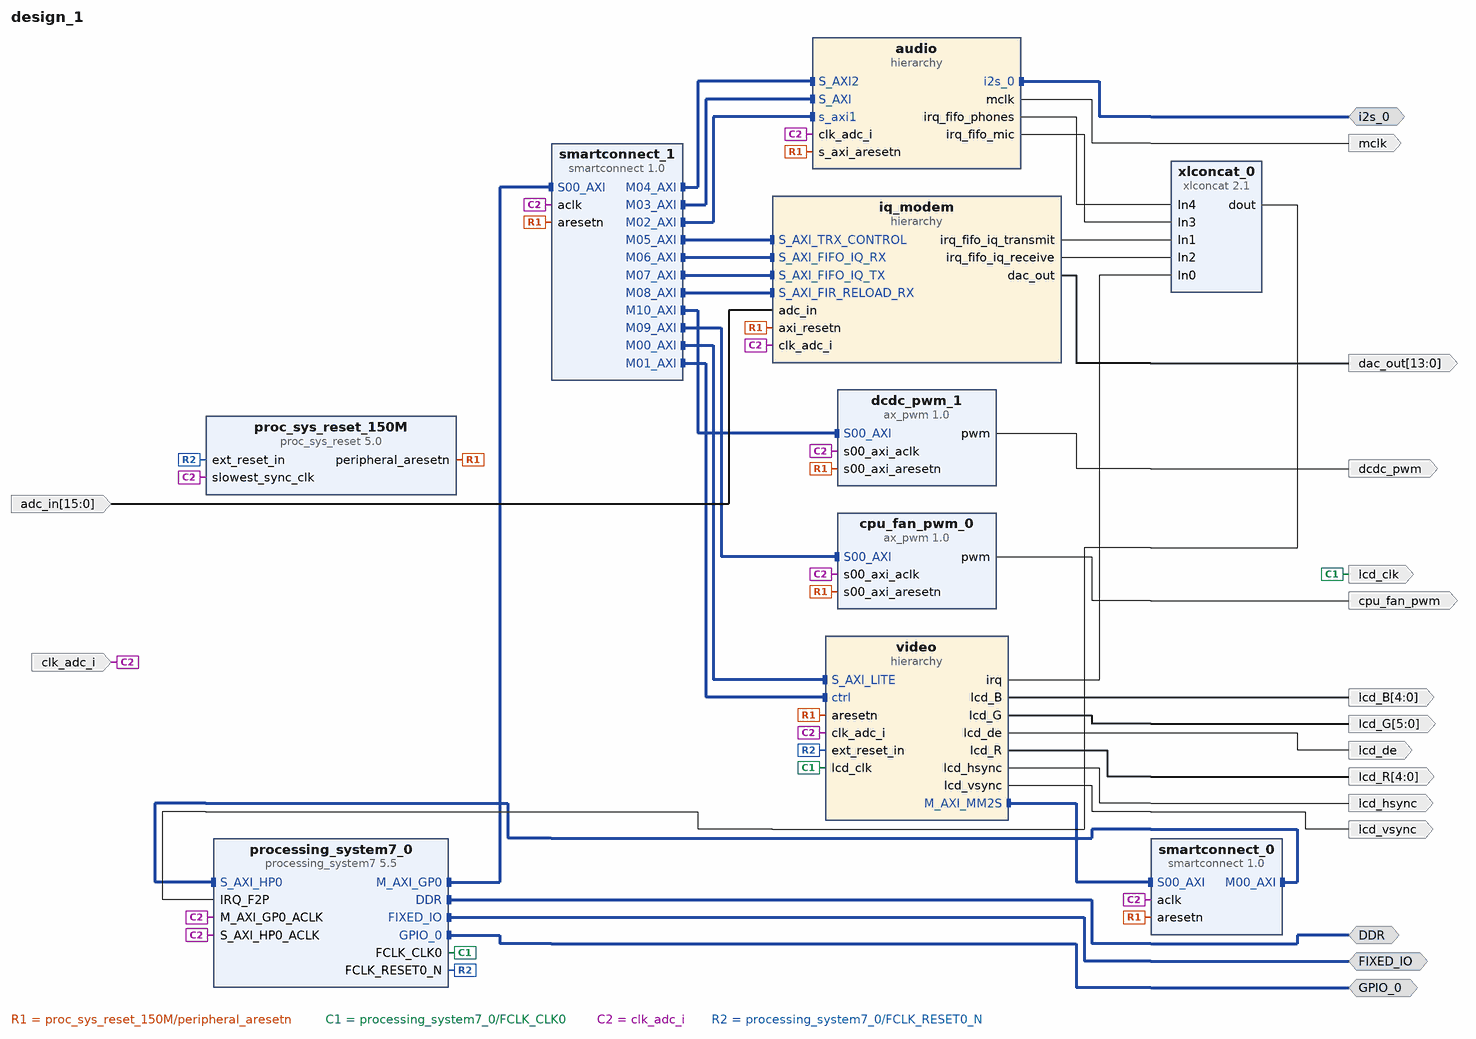
[diagram p0: block diagram of the top level]
# Vivado block design design_1, xc7z020clg400-2, Vivado 2021.1
create_bd_design design_1

create_bd_intf_port -mode Master -vlnv xilinx.com:interface:gpio_rtl:1.0 GPIO_0
create_bd_intf_port -mode Master -vlnv xilinx.com:interface:ddrx_rtl:1.0 DDR
create_bd_intf_port -mode Master -vlnv xilinx.com:display_processing_system7:fixedio_rtl:1.0 FIXED_IO
create_bd_intf_port -mode Master -vlnv analog.com:interface:i2s_rtl:1.0 i2s_0
create_bd_port -dir O -type clk mclk
set_property -dict {CONFIG.FREQ_HZ 12288000} [get_bd_ports mclk]
create_bd_port -dir I -from 15 -to 0 adc_in
create_bd_port -dir O -type clk lcd_clk
set_property -dict {CONFIG.FREQ_HZ 50000000} [get_bd_ports lcd_clk]
create_bd_port -dir O -from 4 -to 0 lcd_R
create_bd_port -dir O -from 5 -to 0 lcd_G
create_bd_port -dir O -from 4 -to 0 lcd_B
create_bd_port -dir O lcd_hsync
create_bd_port -dir O lcd_vsync
create_bd_port -dir O lcd_de
create_bd_port -dir O -from 13 -to 0 dac_out
create_bd_port -dir I -type clk clk_adc_i
set_property -dict {CONFIG.FREQ_HZ 122880000} [get_bd_ports clk_adc_i]
create_bd_port -dir O cpu_fan_pwm
create_bd_port -dir O dcdc_pwm

create_bd_cell -type ip -vlnv xilinx.com:ip:proc_sys_reset:5.0 proc_sys_reset_150M
create_bd_cell -type ip -vlnv xilinx.com:ip:smartconnect:1.0 smartconnect_0
set_property -dict {CONFIG.NUM_SI 1} [get_bd_cells smartconnect_0]
create_bd_cell -type ip -vlnv xilinx.com:ip:smartconnect:1.0 smartconnect_1
set_property -dict {CONFIG.NUM_MI 11 CONFIG.NUM_SI 1} [get_bd_cells smartconnect_1]
create_bd_cell -type ip -vlnv xilinx.com:ip:xlconcat:2.1 xlconcat_0
set_property -dict {CONFIG.NUM_PORTS 5 CONFIG.dout_width 5} [get_bd_cells xlconcat_0]
create_bd_cell -type ip -vlnv xilinx.com:ip:processing_system7:5.5 processing_system7_0
set_property -dict [list \
  CONFIG.PCW_APU_PERIPHERAL_FREQMHZ 767 \
  CONFIG.PCW_CPU_CPU_6X4X_MAX_RANGE 767 \
  CONFIG.PCW_ENET0_ENET0_IO {MIO 16 .. 27} \
  CONFIG.PCW_ENET0_GRP_MDIO_ENABLE 1 \
  CONFIG.PCW_ENET0_GRP_MDIO_IO {MIO 52 .. 53} \
  CONFIG.PCW_ENET0_PERIPHERAL_ENABLE 1 \
  CONFIG.PCW_ENET0_RESET_ENABLE 0 \
  CONFIG.PCW_ENET_RESET_ENABLE 1 \
  CONFIG.PCW_ENET_RESET_SELECT {Share reset pin} \
  CONFIG.PCW_FCLK2_PERIPHERAL_CLKSRC {ARM PLL} \
  CONFIG.PCW_FCLK_CLK0_BUF FALSE \
  CONFIG.PCW_FPGA0_PERIPHERAL_FREQMHZ 50 \
  CONFIG.PCW_FPGA1_PERIPHERAL_FREQMHZ 30 \
  CONFIG.PCW_FPGA2_PERIPHERAL_FREQMHZ 30 \
  CONFIG.PCW_GPIO_EMIO_GPIO_ENABLE 1 \
  CONFIG.PCW_GPIO_EMIO_GPIO_IO 32 \
  CONFIG.PCW_GPIO_EMIO_GPIO_WIDTH 32 \
  CONFIG.PCW_GPIO_MIO_GPIO_ENABLE 1 \
  CONFIG.PCW_GPIO_MIO_GPIO_IO MIO \
  CONFIG.PCW_I2C0_GRP_INT_ENABLE 0 \
  CONFIG.PCW_I2C0_I2C0_IO {MIO 42 .. 43} \
  CONFIG.PCW_I2C0_PERIPHERAL_ENABLE 1 \
  CONFIG.PCW_I2C_PERIPHERAL_FREQMHZ 127.777779 \
  CONFIG.PCW_I2C_RESET_ENABLE 0 \
  CONFIG.PCW_IRQ_F2P_INTR 1 \
  CONFIG.PCW_PERIPHERAL_BOARD_PRESET None \
  CONFIG.PCW_PRESET_BANK1_VOLTAGE {LVCMOS 1.8V} \
  CONFIG.PCW_QSPI_GRP_FBCLK_ENABLE 1 \
  CONFIG.PCW_QSPI_GRP_FBCLK_IO {MIO 8} \
  CONFIG.PCW_QSPI_GRP_SINGLE_SS_ENABLE 1 \
  CONFIG.PCW_QSPI_GRP_SINGLE_SS_IO {MIO 1 .. 6} \
  CONFIG.PCW_QSPI_INTERNAL_HIGHADDRESS 0xFDFFFFFF \
  CONFIG.PCW_QSPI_PERIPHERAL_ENABLE 1 \
  CONFIG.PCW_QSPI_QSPI_IO {MIO 1 .. 6} \
  CONFIG.PCW_SD0_PERIPHERAL_ENABLE 0 \
  CONFIG.PCW_SINGLE_QSPI_DATA_MODE x4 \
  CONFIG.PCW_UART1_PERIPHERAL_ENABLE 1 \
  CONFIG.PCW_UART1_UART1_IO {MIO 48 .. 49} \
  CONFIG.PCW_UART_PERIPHERAL_FREQMHZ 100 \
  CONFIG.PCW_UIPARAM_DDR_FREQ_MHZ 534 \
  CONFIG.PCW_UIPARAM_DDR_PARTNO {MT41K128M16 JT-125} \
  CONFIG.PCW_USB0_PERIPHERAL_ENABLE 1 \
  CONFIG.PCW_USB0_RESET_ENABLE 1 \
  CONFIG.PCW_USB0_RESET_IO {MIO 46} \
  CONFIG.PCW_USB0_USB0_IO {MIO 28 .. 39} \
  CONFIG.PCW_USB_RESET_ENABLE 1 \
  CONFIG.PCW_USB_RESET_SELECT {Share reset pin} \
  CONFIG.PCW_USE_FABRIC_INTERRUPT 1 \
  CONFIG.PCW_USE_S_AXI_HP0 1 \
  CONFIG.preset None \
] [get_bd_cells processing_system7_0]
# 502 more settings of processing_system7_0 are not shown: defaults, MIO pin electricals, DDR timing, and values the tool derives
create_bd_cell -type ip -vlnv xilinx.com:user:ax_pwm:1.0 cpu_fan_pwm_0
create_bd_cell -type ip -vlnv xilinx.com:user:ax_pwm:1.0 dcdc_pwm_1
create_bd_cell -type hier audio
create_bd_cell -type hier video
create_bd_cell -type hier iq_modem

# ---- hierarchy /audio ----
current_bd_instance /audio
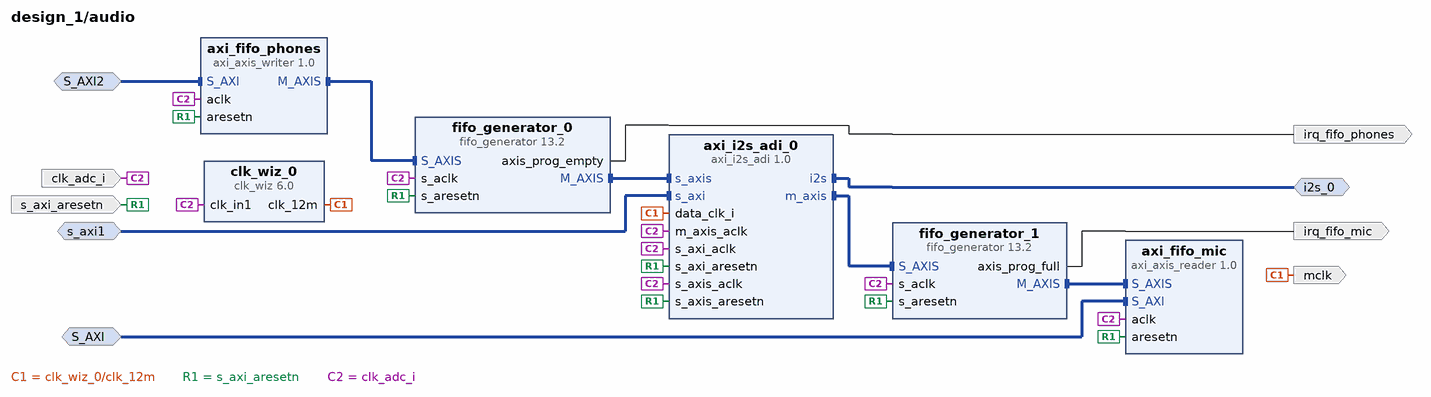
[diagram p1: block diagram inside /audio]
create_bd_intf_pin -mode Slave -vlnv xilinx.com:interface:aximm_rtl:1.0 s_axi1
create_bd_intf_pin -mode Master -vlnv analog.com:interface:i2s_rtl:1.0 i2s_0
create_bd_intf_pin -mode Slave -vlnv xilinx.com:interface:aximm_rtl:1.0 S_AXI
create_bd_intf_pin -mode Slave -vlnv xilinx.com:interface:aximm_rtl:1.0 S_AXI2
create_bd_pin -dir I -type clk clk_adc_i
create_bd_pin -dir I -type rst s_axi_aresetn
create_bd_pin -dir O -type clk mclk
create_bd_pin -dir O -type intr irq_fifo_phones
create_bd_pin -dir O -type intr irq_fifo_mic

create_bd_cell -type ip -vlnv analog.com:adi:axi_i2s_adi:1.0 axi_i2s_adi_0
set_property -dict {CONFIG.BCLK_POL 0 CONFIG.HAS_RX 1 CONFIG.HAS_TX 1 CONFIG.LRCLK_POL 0} [get_bd_cells axi_i2s_adi_0]
create_bd_cell -type ip -vlnv xilinx.com:ip:clk_wiz:6.0 clk_wiz_0
set_property -dict [list \
  CONFIG.CLKOUT1_JITTER 205.165 \
  CONFIG.CLKOUT1_PHASE_ERROR 112.102 \
  CONFIG.CLKOUT1_REQUESTED_OUT_FREQ 12.288 \
  CONFIG.CLK_OUT1_PORT clk_12m \
  CONFIG.MMCM_CLKFBOUT_MULT_F 6.125 \
  CONFIG.MMCM_CLKOUT0_DIVIDE_F 61.250 \
  CONFIG.MMCM_DIVCLK_DIVIDE 1 \
  CONFIG.USE_LOCKED false \
  CONFIG.USE_RESET false \
] [get_bd_cells clk_wiz_0]
create_bd_cell -type ip -vlnv xilinx.com:ip:fifo_generator:13.2 fifo_generator_0
set_property -dict [list \
  CONFIG.Empty_Threshold_Assert_Value_axis 132 \
  CONFIG.Enable_Safety_Circuit true \
  CONFIG.FIFO_Implementation_rach Common_Clock_Distributed_RAM \
  CONFIG.FIFO_Implementation_wach Common_Clock_Distributed_RAM \
  CONFIG.FIFO_Implementation_wrch Common_Clock_Distributed_RAM \
  CONFIG.Full_Flags_Reset_Value 1 \
  CONFIG.INTERFACE_TYPE AXI_STREAM \
  CONFIG.Input_Depth_axis 512 \
  CONFIG.Programmable_Empty_Type_axis Single_Programmable_Empty_Threshold_Constant \
  CONFIG.TDATA_NUM_BYTES 4 \
  CONFIG.TUSER_WIDTH 0 \
] [get_bd_cells fifo_generator_0]
create_bd_cell -type ip -vlnv xilinx.com:ip:fifo_generator:13.2 fifo_generator_1
set_property -dict [list \
  CONFIG.Enable_Safety_Circuit true \
  CONFIG.FIFO_Implementation_rach Common_Clock_Distributed_RAM \
  CONFIG.FIFO_Implementation_wach Common_Clock_Distributed_RAM \
  CONFIG.FIFO_Implementation_wrch Common_Clock_Distributed_RAM \
  CONFIG.Full_Flags_Reset_Value 1 \
  CONFIG.Full_Threshold_Assert_Value_axis 132 \
  CONFIG.INTERFACE_TYPE AXI_STREAM \
  CONFIG.Input_Depth_axis 256 \
  CONFIG.Programmable_Full_Type_axis Single_Programmable_Full_Threshold_Constant \
  CONFIG.TDATA_NUM_BYTES 4 \
  CONFIG.TUSER_WIDTH 0 \
] [get_bd_cells fifo_generator_1]
create_bd_cell -type ip -vlnv pavel-demin:user:axi_axis_reader:1.0 axi_fifo_mic
create_bd_cell -type ip -vlnv pavel-demin:user:axi_axis_writer:1.0 axi_fifo_phones

# ---- hierarchy /video ----
current_bd_instance /video
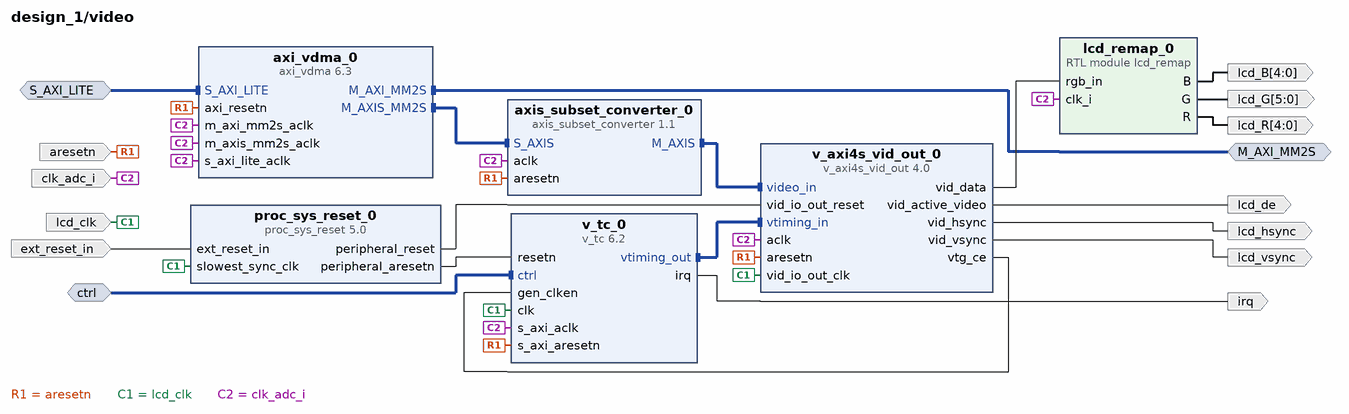
[diagram p2: block diagram inside /video]
create_bd_intf_pin -mode Slave -vlnv xilinx.com:interface:aximm_rtl:1.0 S_AXI_LITE
create_bd_intf_pin -mode Master -vlnv xilinx.com:interface:aximm_rtl:1.0 M_AXI_MM2S
create_bd_intf_pin -mode Slave -vlnv xilinx.com:interface:aximm_rtl:1.0 ctrl
create_bd_pin -dir I -type clk clk_adc_i
create_bd_pin -dir I -type rst aresetn
create_bd_pin -dir I -type clk lcd_clk
create_bd_pin -dir I -type rst ext_reset_in
create_bd_pin -dir O -type intr irq
create_bd_pin -dir O -from 4 -to 0 lcd_R
create_bd_pin -dir O -from 5 -to 0 lcd_G
create_bd_pin -dir O -from 4 -to 0 lcd_B
create_bd_pin -dir O lcd_vsync
create_bd_pin -dir O lcd_de
create_bd_pin -dir O lcd_hsync

create_bd_cell -type ip -vlnv xilinx.com:ip:axi_vdma:6.3 axi_vdma_0
set_property -dict [list \
  CONFIG.C_FAMILY zynquplus \
  CONFIG.c_addr_width 32 \
  CONFIG.c_include_mm2s 1 \
  CONFIG.c_include_mm2s_dre 0 \
  CONFIG.c_include_s2mm 0 \
  CONFIG.c_m_axi_mm2s_data_width 32 \
  CONFIG.c_m_axis_mm2s_tdata_width 32 \
  CONFIG.c_mm2s_genlock_mode 3 \
  CONFIG.c_mm2s_linebuffer_depth 2048 \
  CONFIG.c_mm2s_max_burst_length 16 \
  CONFIG.c_num_fstores 3 \
] [get_bd_cells axi_vdma_0]
create_bd_cell -type ip -vlnv xilinx.com:ip:axis_subset_converter:1.1 axis_subset_converter_0
set_property -dict [list \
  CONFIG.M_HAS_TKEEP 1 \
  CONFIG.M_HAS_TLAST 1 \
  CONFIG.M_TDATA_NUM_BYTES 3 \
  CONFIG.M_TUSER_WIDTH 1 \
  CONFIG.S_HAS_TKEEP 1 \
  CONFIG.S_HAS_TLAST 1 \
  CONFIG.S_TDATA_NUM_BYTES 4 \
  CONFIG.S_TUSER_WIDTH 1 \
  CONFIG.TDATA_REMAP {tdata[23:0]} \
  CONFIG.TKEEP_REMAP {tkeep[2:0]} \
  CONFIG.TLAST_REMAP {tlast[0]} \
  CONFIG.TUSER_REMAP {tuser[0:0]} \
] [get_bd_cells axis_subset_converter_0]
create_bd_cell -type ip -vlnv xilinx.com:ip:proc_sys_reset:5.0 proc_sys_reset_0
create_bd_cell -type ip -vlnv xilinx.com:ip:v_tc:6.2 v_tc_0
set_property -dict {CONFIG.enable_detection false} [get_bd_cells v_tc_0]
create_bd_cell -type module -reference lcd_remap lcd_remap_0
create_bd_cell -type ip -vlnv xilinx.com:ip:v_axi4s_vid_out:4.0 v_axi4s_vid_out_0
set_property -dict {CONFIG.C_ADDR_WIDTH 12 CONFIG.C_HAS_ASYNC_CLK 1 CONFIG.C_VTG_MASTER_SLAVE 1} [get_bd_cells v_axi4s_vid_out_0]

# ---- hierarchy /iq_modem ----
current_bd_instance /iq_modem
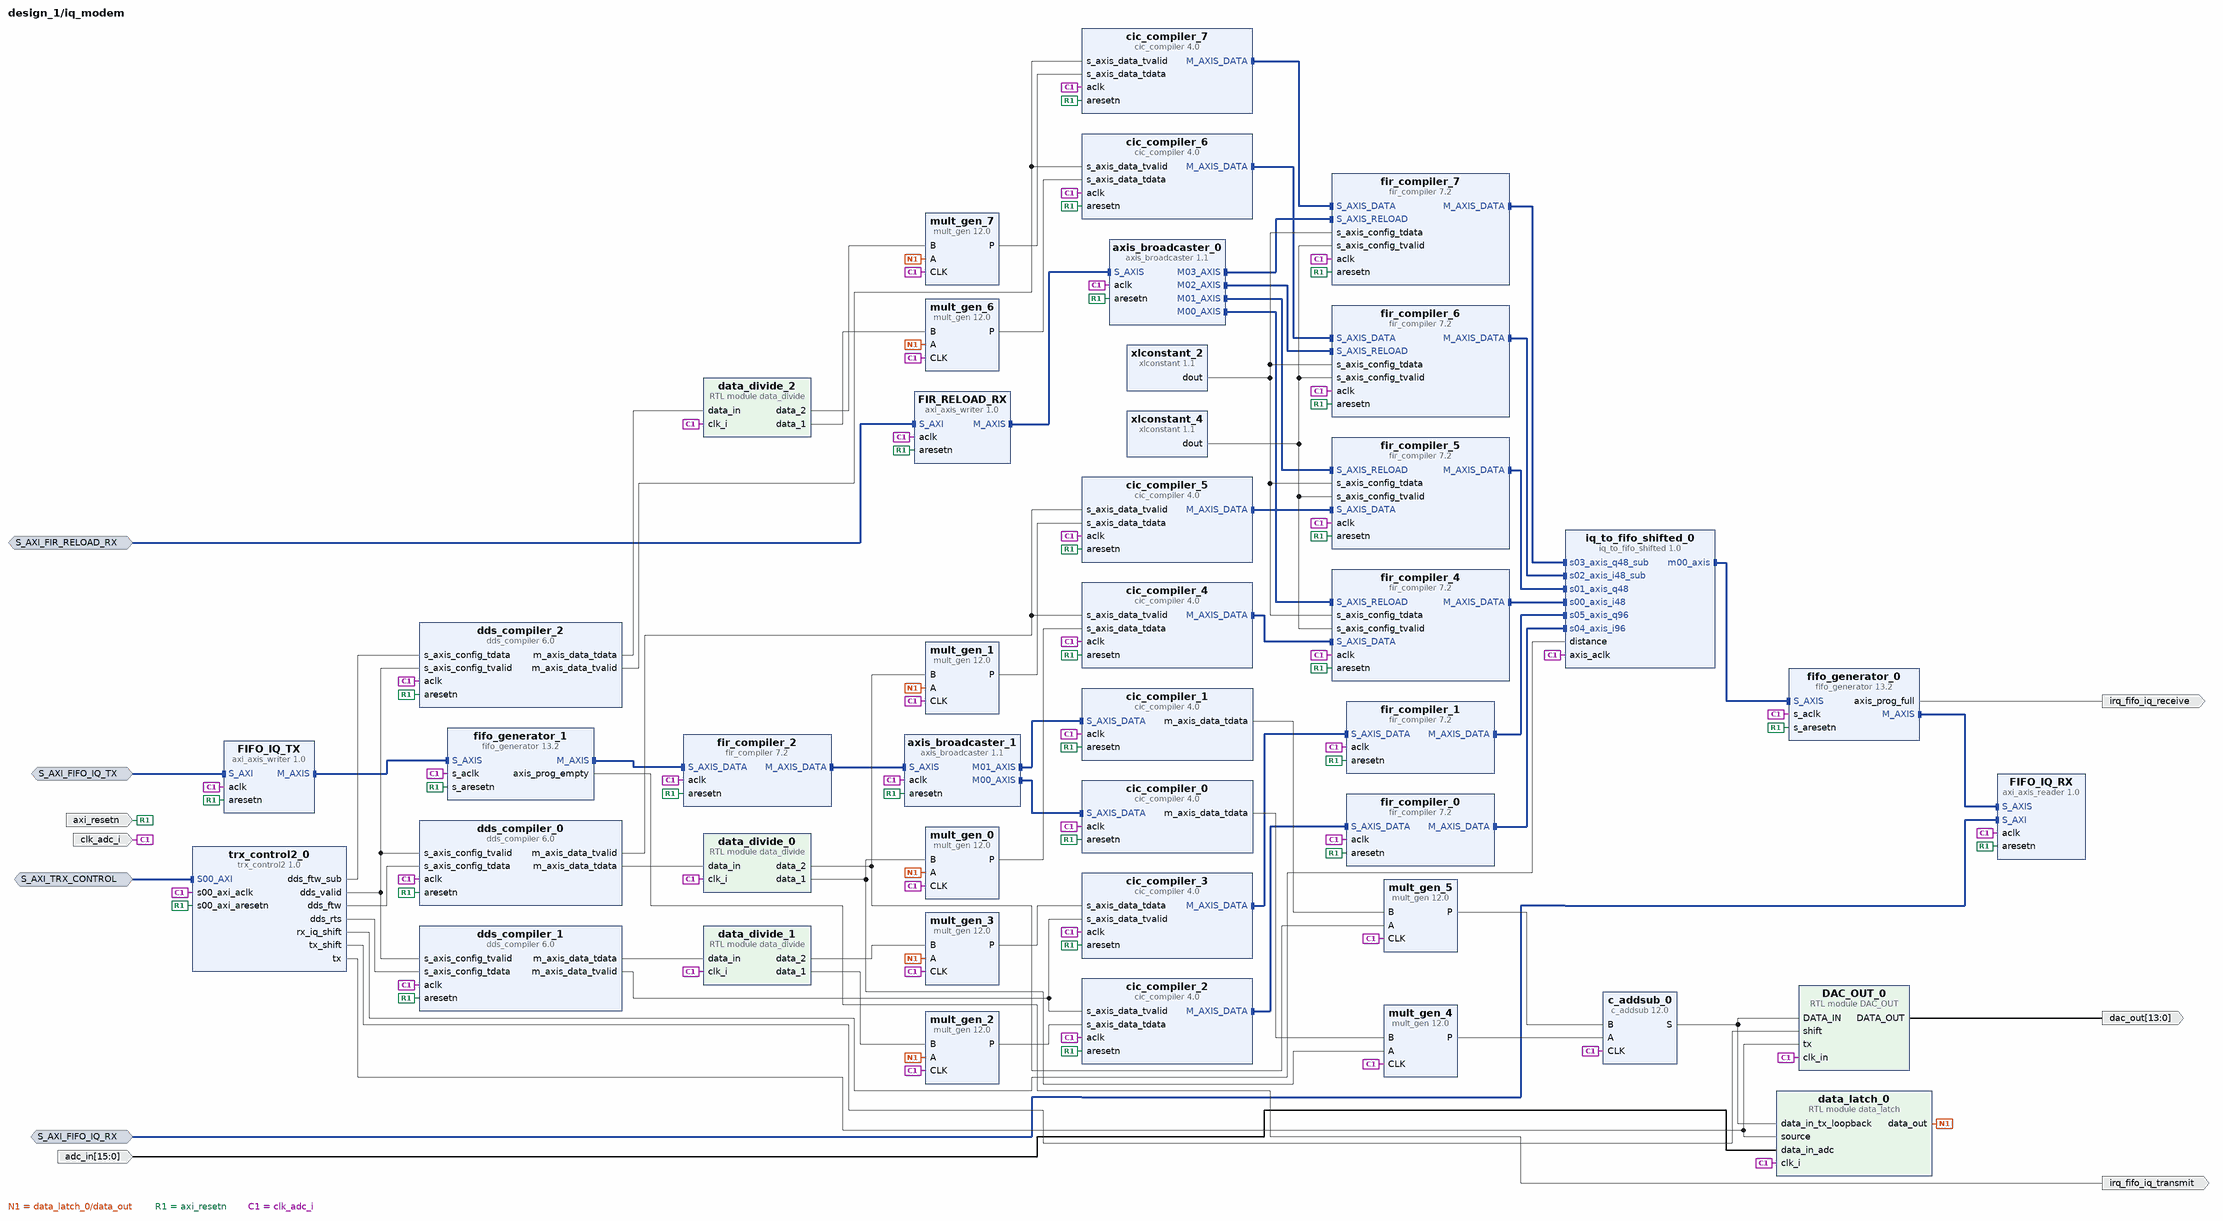
[diagram p3: block diagram inside /iq_modem]
create_bd_intf_pin -mode Slave -vlnv xilinx.com:interface:aximm_rtl:1.0 S_AXI_TRX_CONTROL
create_bd_intf_pin -mode Slave -vlnv xilinx.com:interface:aximm_rtl:1.0 S_AXI_FIFO_IQ_RX
create_bd_intf_pin -mode Slave -vlnv xilinx.com:interface:aximm_rtl:1.0 S_AXI_FIFO_IQ_TX
create_bd_intf_pin -mode Slave -vlnv xilinx.com:interface:aximm_rtl:1.0 S_AXI_FIR_RELOAD_RX
create_bd_pin -dir I -type clk clk_adc_i
create_bd_pin -dir I -type rst axi_resetn
create_bd_pin -dir I -from 15 -to 0 adc_in
create_bd_pin -dir O -from 13 -to 0 dac_out
create_bd_pin -dir O -type intr irq_fifo_iq_transmit
create_bd_pin -dir O -type intr irq_fifo_iq_receive

create_bd_cell -type ip -vlnv xilinx.com:user:trx_control2:1.0 trx_control2_0
create_bd_cell -type ip -vlnv xilinx.com:ip:dds_compiler:6.0 dds_compiler_2
set_property -dict [list \
  CONFIG.DATA_Has_TLAST Not_Required \
  CONFIG.DDS_Clock_Rate 122.88 \
  CONFIG.DSP48_Use Maximal \
  CONFIG.Frequency_Resolution 0.4 \
  CONFIG.Has_ARESETn true \
  CONFIG.Has_Phase_Out false \
  CONFIG.Latency 9 \
  CONFIG.M_DATA_Has_TUSER Not_Required \
  CONFIG.Noise_Shaping None \
  CONFIG.Optimization_Goal Speed \
  CONFIG.Output_Frequency1 0 \
  CONFIG.Output_Width 16 \
  CONFIG.PINC1 1101010101010101 \
  CONFIG.Parameter_Entry Hardware_Parameters \
  CONFIG.Phase_Increment Programmable \
  CONFIG.Phase_Width 32 \
  CONFIG.S_PHASE_Has_TUSER Not_Required \
] [get_bd_cells dds_compiler_2]
create_bd_cell -type ip -vlnv xilinx.com:ip:cic_compiler:4.0 cic_compiler_7
set_property -dict [list \
  CONFIG.Clock_Frequency 200.0 \
  CONFIG.Filter_Type Decimation \
  CONFIG.Fixed_Or_Initial_Rate 2560 \
  CONFIG.HAS_ARESETN true \
  CONFIG.Input_Data_Width 31 \
  CONFIG.Input_Sample_Frequency 0.001 \
  CONFIG.Maximum_Rate 2560 \
  CONFIG.Minimum_Rate 2560 \
  CONFIG.Number_Of_Channels 1 \
  CONFIG.Number_Of_Stages 6 \
  CONFIG.Output_Data_Width 32 \
  CONFIG.Quantization Truncation \
  CONFIG.RateSpecification Sample_Period \
  CONFIG.SamplePeriod 1 \
] [get_bd_cells cic_compiler_7]
create_bd_cell -type ip -vlnv xilinx.com:ip:axis_broadcaster:1.1 axis_broadcaster_0
set_property -dict [list \
  CONFIG.HAS_TLAST 1 \
  CONFIG.HAS_TREADY 1 \
  CONFIG.M00_TDATA_REMAP {tdata[31],tdata[22:0]} \
  CONFIG.M01_TDATA_REMAP {tdata[31],tdata[22:0]} \
  CONFIG.M02_TDATA_REMAP {tdata[31],tdata[22:0]} \
  CONFIG.M03_TDATA_REMAP {tdata[31],tdata[22:0]} \
  CONFIG.M04_TDATA_REMAP {tdata[31],tdata[22:0]} \
  CONFIG.M05_TDATA_REMAP {tdata[31],tdata[22:0]} \
  CONFIG.M_TDATA_NUM_BYTES 3 \
  CONFIG.NUM_MI 4 \
  CONFIG.S_TDATA_NUM_BYTES 4 \
] [get_bd_cells axis_broadcaster_0]
create_bd_cell -type ip -vlnv xilinx.com:ip:axis_broadcaster:1.1 axis_broadcaster_1
set_property -dict [list \
  CONFIG.HAS_TLAST 1 \
  CONFIG.HAS_TREADY 1 \
  CONFIG.M00_TDATA_REMAP {tdata[15:0]} \
  CONFIG.M01_TDATA_REMAP {tdata[31:16]} \
  CONFIG.M_TDATA_NUM_BYTES 2 \
  CONFIG.S_TDATA_NUM_BYTES 4 \
] [get_bd_cells axis_broadcaster_1]
create_bd_cell -type ip -vlnv xilinx.com:ip:mult_gen:12.0 mult_gen_0
set_property -dict [list \
  CONFIG.Multiplier_Construction Use_Mults \
  CONFIG.PipeStages 4 \
  CONFIG.PortAWidth 16 \
  CONFIG.PortBWidth 16 \
  CONFIG.Use_Custom_Output_Width false \
] [get_bd_cells mult_gen_0]
create_bd_cell -type ip -vlnv xilinx.com:ip:fir_compiler:7.2 fir_compiler_0
set_property -dict [list \
  CONFIG.Clock_Frequency 122.88 \
  CONFIG.CoefficientSource COE_File \
  CONFIG.Coefficient_File ../../../../../../src/fir.coe \
  CONFIG.Coefficient_Fractional_Bits 1 \
  CONFIG.Coefficient_Sets 1 \
  CONFIG.Coefficient_Sign Signed \
  CONFIG.Coefficient_Structure Non_Symmetric \
  CONFIG.Coefficient_Width 24 \
  CONFIG.ColumnConfig 1 \
  CONFIG.Data_Fractional_Bits 0 \
  CONFIG.Data_Sign Signed \
  CONFIG.Data_Width 32 \
  CONFIG.Decimation_Rate 2 \
  CONFIG.Filter_Architecture Systolic_Multiply_Accumulate \
  CONFIG.Filter_Type Decimation \
  CONFIG.Has_ACLKEN false \
  CONFIG.Has_ARESETn true \
  CONFIG.Interpolation_Rate 1 \
  CONFIG.Number_Channels 1 \
  CONFIG.Output_Rounding_Mode Convergent_Rounding_to_Even \
  CONFIG.Output_Width 32 \
  CONFIG.Quantization Normalize_to_Centre_Coefficient \
  CONFIG.RateSpecification Frequency_Specification \
  CONFIG.S_DATA_Has_FIFO false \
  CONFIG.Sample_Frequency 0.192 \
  CONFIG.Zero_Pack_Factor 1 \
] [get_bd_cells fir_compiler_0]
create_bd_cell -type ip -vlnv xilinx.com:ip:mult_gen:12.0 mult_gen_1
set_property -dict [list \
  CONFIG.Multiplier_Construction Use_Mults \
  CONFIG.PipeStages 4 \
  CONFIG.PortAWidth 16 \
  CONFIG.PortBWidth 16 \
  CONFIG.Use_Custom_Output_Width false \
] [get_bd_cells mult_gen_1]
create_bd_cell -type ip -vlnv xilinx.com:ip:fir_compiler:7.2 fir_compiler_1
set_property -dict [list \
  CONFIG.Clock_Frequency 122.88 \
  CONFIG.CoefficientSource COE_File \
  CONFIG.Coefficient_File ../../../../../../src/fir.coe \
  CONFIG.Coefficient_Fractional_Bits 1 \
  CONFIG.Coefficient_Sets 1 \
  CONFIG.Coefficient_Sign Signed \
  CONFIG.Coefficient_Structure Non_Symmetric \
  CONFIG.Coefficient_Width 24 \
  CONFIG.ColumnConfig 1 \
  CONFIG.Data_Fractional_Bits 0 \
  CONFIG.Data_Sign Signed \
  CONFIG.Data_Width 32 \
  CONFIG.Decimation_Rate 2 \
  CONFIG.Filter_Architecture Systolic_Multiply_Accumulate \
  CONFIG.Filter_Type Decimation \
  CONFIG.Has_ACLKEN false \
  CONFIG.Has_ARESETn true \
  CONFIG.Interpolation_Rate 1 \
  CONFIG.Number_Channels 1 \
  CONFIG.Output_Rounding_Mode Convergent_Rounding_to_Even \
  CONFIG.Output_Width 32 \
  CONFIG.Quantization Normalize_to_Centre_Coefficient \
  CONFIG.RateSpecification Frequency_Specification \
  CONFIG.S_DATA_Has_FIFO false \
  CONFIG.Sample_Frequency 0.192 \
  CONFIG.Zero_Pack_Factor 1 \
] [get_bd_cells fir_compiler_1]
create_bd_cell -type ip -vlnv xilinx.com:ip:mult_gen:12.0 mult_gen_2
set_property -dict [list \
  CONFIG.Multiplier_Construction Use_Mults \
  CONFIG.PipeStages 4 \
  CONFIG.PortAWidth 16 \
  CONFIG.PortBWidth 16 \
] [get_bd_cells mult_gen_2]
create_bd_cell -type ip -vlnv xilinx.com:ip:fir_compiler:7.2 fir_compiler_2
set_property -dict [list \
  CONFIG.Clock_Frequency 122.88 \
  CONFIG.CoefficientSource COE_File \
  CONFIG.CoefficientVector 6,0,-4,-3,5,6,-6,-13,7,44,64,44,7,-13,-6,6,5,-3,-4,0,6 \
  CONFIG.Coefficient_File ../../../../../../src/fir.coe \
  CONFIG.Coefficient_Fractional_Bits 1 \
  CONFIG.Coefficient_Reload false \
  CONFIG.Coefficient_Sets 1 \
  CONFIG.Coefficient_Sign Signed \
  CONFIG.Coefficient_Structure Non_Symmetric \
  CONFIG.Coefficient_Width 24 \
  CONFIG.Data_Fractional_Bits 0 \
  CONFIG.Data_Sign Signed \
  CONFIG.Data_Width 16 \
  CONFIG.Decimation_Rate 1 \
  CONFIG.Filter_Architecture Systolic_Multiply_Accumulate \
  CONFIG.Filter_Type Single_Rate \
  CONFIG.Has_ACLKEN false \
  CONFIG.Has_ARESETn true \
  CONFIG.Interpolation_Rate 1 \
  CONFIG.M_DATA_Has_TREADY true \
  CONFIG.Number_Channels 1 \
  CONFIG.Number_Paths 2 \
  CONFIG.Output_Rounding_Mode Truncate_LSBs \
  CONFIG.Output_Width 16 \
  CONFIG.Quantization Normalize_to_Centre_Coefficient \
  CONFIG.RateSpecification Frequency_Specification \
  CONFIG.Sample_Frequency 0.048 \
  CONFIG.Zero_Pack_Factor 1 \
] [get_bd_cells fir_compiler_2]
create_bd_cell -type ip -vlnv xilinx.com:user:iq_to_fifo_shifted:1.0 iq_to_fifo_shifted_0
set_property -dict {CONFIG.iq_width 56} [get_bd_cells iq_to_fifo_shifted_0]
create_bd_cell -type ip -vlnv xilinx.com:ip:mult_gen:12.0 mult_gen_3
set_property -dict [list \
  CONFIG.Multiplier_Construction Use_Mults \
  CONFIG.PipeStages 4 \
  CONFIG.PortAWidth 16 \
  CONFIG.PortBWidth 16 \
] [get_bd_cells mult_gen_3]
create_bd_cell -type ip -vlnv xilinx.com:ip:xlconstant:1.1 xlconstant_2
set_property -dict {CONFIG.CONST_VAL 0 CONFIG.CONST_WIDTH 8} [get_bd_cells xlconstant_2]
create_bd_cell -type ip -vlnv xilinx.com:ip:cic_compiler:4.0 cic_compiler_0
set_property -dict [list \
  CONFIG.Clock_Frequency 122.88 \
  CONFIG.Fixed_Or_Initial_Rate 2560 \
  CONFIG.HAS_ARESETN true \
  CONFIG.Input_Data_Width 16 \
  CONFIG.Input_Sample_Frequency 0.048 \
  CONFIG.Maximum_Rate 2560 \
  CONFIG.Minimum_Rate 2560 \
  CONFIG.Number_Of_Stages 6 \
  CONFIG.Output_Data_Width 16 \
  CONFIG.Quantization Truncation \
  CONFIG.SamplePeriod 2560 \
] [get_bd_cells cic_compiler_0]
create_bd_cell -type ip -vlnv xilinx.com:ip:c_addsub:12.0 c_addsub_0
set_property -dict [list \
  CONFIG.A_Type Signed \
  CONFIG.A_Width 27 \
  CONFIG.B_Type Signed \
  CONFIG.B_Value 000000000000000000000000000 \
  CONFIG.B_Width 27 \
  CONFIG.CE false \
  CONFIG.Implementation DSP48 \
  CONFIG.Latency 2 \
  CONFIG.Latency_Configuration Automatic \
  CONFIG.Out_Width 27 \
] [get_bd_cells c_addsub_0]
create_bd_cell -type ip -vlnv xilinx.com:ip:cic_compiler:4.0 cic_compiler_1
set_property -dict [list \
  CONFIG.Clock_Frequency 122.88 \
  CONFIG.Fixed_Or_Initial_Rate 2560 \
  CONFIG.HAS_ARESETN true \
  CONFIG.Input_Data_Width 16 \
  CONFIG.Input_Sample_Frequency 0.048 \
  CONFIG.Maximum_Rate 2560 \
  CONFIG.Minimum_Rate 2560 \
  CONFIG.Number_Of_Stages 6 \
  CONFIG.Output_Data_Width 16 \
  CONFIG.Quantization Truncation \
  CONFIG.SamplePeriod 2560 \
] [get_bd_cells cic_compiler_1]
create_bd_cell -type module -reference data_latch data_latch_0
create_bd_cell -type ip -vlnv xilinx.com:ip:fir_compiler:7.2 fir_compiler_4
set_property -dict [list \
  CONFIG.Clock_Frequency 122.88 \
  CONFIG.CoefficientSource COE_File \
  CONFIG.Coefficient_File ../../../../../../src/fir.coe \
  CONFIG.Coefficient_Fractional_Bits 1 \
  CONFIG.Coefficient_Reload true \
  CONFIG.Coefficient_Sets 1 \
  CONFIG.Coefficient_Sign Signed \
  CONFIG.Coefficient_Structure Non_Symmetric \
  CONFIG.Coefficient_Width 24 \
  CONFIG.Data_Fractional_Bits 0 \
  CONFIG.Data_Sign Signed \
  CONFIG.Data_Width 32 \
  CONFIG.Filter_Architecture Systolic_Multiply_Accumulate \
  CONFIG.Has_ARESETn true \
  CONFIG.Output_Rounding_Mode Truncate_LSBs \
  CONFIG.Output_Width 56 \
  CONFIG.Quantization Normalize_to_Centre_Coefficient \
  CONFIG.Sample_Frequency 0.048 \
] [get_bd_cells fir_compiler_4]
create_bd_cell -type ip -vlnv xilinx.com:ip:mult_gen:12.0 mult_gen_4
set_property -dict [list \
  CONFIG.OutputWidthHigh 30 \
  CONFIG.OutputWidthLow 4 \
  CONFIG.PortAType Signed \
  CONFIG.PortAWidth 16 \
  CONFIG.PortBType Signed \
  CONFIG.PortBWidth 16 \
  CONFIG.Use_Custom_Output_Width true \
] [get_bd_cells mult_gen_4]
create_bd_cell -type module -reference DAC_OUT DAC_OUT_0
create_bd_cell -type ip -vlnv xilinx.com:ip:mult_gen:12.0 mult_gen_5
set_property -dict [list \
  CONFIG.OutputWidthHigh 30 \
  CONFIG.OutputWidthLow 4 \
  CONFIG.PortAType Signed \
  CONFIG.PortAWidth 16 \
  CONFIG.PortBType Signed \
  CONFIG.PortBWidth 16 \
  CONFIG.Use_Custom_Output_Width true \
] [get_bd_cells mult_gen_5]
create_bd_cell -type ip -vlnv xilinx.com:ip:fir_compiler:7.2 fir_compiler_5
set_property -dict [list \
  CONFIG.Clock_Frequency 122.88 \
  CONFIG.CoefficientSource COE_File \
  CONFIG.Coefficient_File ../../../../../../src/fir.coe \
  CONFIG.Coefficient_Fractional_Bits 1 \
  CONFIG.Coefficient_Reload true \
  CONFIG.Coefficient_Sets 1 \
  CONFIG.Coefficient_Sign Signed \
  CONFIG.Coefficient_Structure Non_Symmetric \
  CONFIG.Coefficient_Width 24 \
  CONFIG.Data_Fractional_Bits 0 \
  CONFIG.Data_Sign Signed \
  CONFIG.Data_Width 32 \
  CONFIG.Filter_Architecture Systolic_Multiply_Accumulate \
  CONFIG.Has_ARESETn true \
  CONFIG.Output_Rounding_Mode Truncate_LSBs \
  CONFIG.Output_Width 56 \
  CONFIG.Quantization Normalize_to_Centre_Coefficient \
  CONFIG.Sample_Frequency 0.048 \
] [get_bd_cells fir_compiler_5]
create_bd_cell -type ip -vlnv xilinx.com:ip:cic_compiler:4.0 cic_compiler_2
set_property -dict [list \
  CONFIG.Clock_Frequency 200.0 \
  CONFIG.Filter_Type Decimation \
  CONFIG.Fixed_Or_Initial_Rate 640 \
  CONFIG.HAS_ACLKEN false \
  CONFIG.HAS_ARESETN true \
  CONFIG.Input_Data_Width 31 \
  CONFIG.Input_Sample_Frequency 0.001 \
  CONFIG.Maximum_Rate 640 \
  CONFIG.Minimum_Rate 640 \
  CONFIG.Number_Of_Stages 6 \
  CONFIG.Output_Data_Width 32 \
  CONFIG.Quantization Truncation \
  CONFIG.RateSpecification Sample_Period \
  CONFIG.SamplePeriod 1 \
  CONFIG.Use_Xtreme_DSP_Slice false \
] [get_bd_cells cic_compiler_2]
create_bd_cell -type module -reference data_divide data_divide_0
create_bd_cell -type ip -vlnv xilinx.com:ip:xlconstant:1.1 xlconstant_4
set_property -dict {CONFIG.CONST_VAL 1 CONFIG.CONST_WIDTH 1} [get_bd_cells xlconstant_4]
create_bd_cell -type ip -vlnv xilinx.com:ip:fir_compiler:7.2 fir_compiler_6
set_property -dict [list \
  CONFIG.Clock_Frequency 122.88 \
  CONFIG.CoefficientSource COE_File \
  CONFIG.Coefficient_File ../../../../../../src/fir.coe \
  CONFIG.Coefficient_Fractional_Bits 1 \
  CONFIG.Coefficient_Reload true \
  CONFIG.Coefficient_Sets 1 \
  CONFIG.Coefficient_Sign Signed \
  CONFIG.Coefficient_Structure Non_Symmetric \
  CONFIG.Coefficient_Width 24 \
  CONFIG.Data_Fractional_Bits 0 \
  CONFIG.Data_Sign Signed \
  CONFIG.Data_Width 32 \
  CONFIG.Filter_Architecture Systolic_Multiply_Accumulate \
  CONFIG.Has_ARESETn true \
  CONFIG.Output_Rounding_Mode Truncate_LSBs \
  CONFIG.Output_Width 56 \
  CONFIG.Quantization Normalize_to_Centre_Coefficient \
  CONFIG.Sample_Frequency 0.048 \
] [get_bd_cells fir_compiler_6]
create_bd_cell -type module -reference data_divide data_divide_1
create_bd_cell -type ip -vlnv xilinx.com:ip:mult_gen:12.0 mult_gen_6
set_property -dict [list \
  CONFIG.Multiplier_Construction Use_Mults \
  CONFIG.PipeStages 4 \
  CONFIG.PortAWidth 16 \
  CONFIG.PortBWidth 16 \
  CONFIG.Use_Custom_Output_Width false \
] [get_bd_cells mult_gen_6]
create_bd_cell -type ip -vlnv xilinx.com:ip:cic_compiler:4.0 cic_compiler_3
set_property -dict [list \
  CONFIG.Clock_Frequency 200.0 \
  CONFIG.Filter_Type Decimation \
  CONFIG.Fixed_Or_Initial_Rate 640 \
  CONFIG.HAS_ACLKEN false \
  CONFIG.HAS_ARESETN true \
  CONFIG.Input_Data_Width 31 \
  CONFIG.Input_Sample_Frequency 0.001 \
  CONFIG.Maximum_Rate 640 \
  CONFIG.Minimum_Rate 640 \
  CONFIG.Number_Of_Stages 6 \
  CONFIG.Output_Data_Width 32 \
  CONFIG.Quantization Truncation \
  CONFIG.RateSpecification Sample_Period \
  CONFIG.SamplePeriod 1 \
  CONFIG.Use_Xtreme_DSP_Slice false \
] [get_bd_cells cic_compiler_3]
create_bd_cell -type ip -vlnv xilinx.com:ip:cic_compiler:4.0 cic_compiler_4
set_property -dict [list \
  CONFIG.Clock_Frequency 200.0 \
  CONFIG.Filter_Type Decimation \
  CONFIG.Fixed_Or_Initial_Rate 2560 \
  CONFIG.HAS_ARESETN true \
  CONFIG.Input_Data_Width 31 \
  CONFIG.Input_Sample_Frequency 0.001 \
  CONFIG.Maximum_Rate 2560 \
  CONFIG.Minimum_Rate 2560 \
  CONFIG.Number_Of_Channels 1 \
  CONFIG.Number_Of_Stages 6 \
  CONFIG.Output_Data_Width 32 \
  CONFIG.Quantization Truncation \
  CONFIG.RateSpecification Sample_Period \
  CONFIG.SamplePeriod 1 \
] [get_bd_cells cic_compiler_4]
create_bd_cell -type ip -vlnv xilinx.com:ip:fir_compiler:7.2 fir_compiler_7
set_property -dict [list \
  CONFIG.Clock_Frequency 122.88 \
  CONFIG.CoefficientSource COE_File \
  CONFIG.Coefficient_File ../../../../../../src/fir.coe \
  CONFIG.Coefficient_Fractional_Bits 1 \
  CONFIG.Coefficient_Reload true \
  CONFIG.Coefficient_Sets 1 \
  CONFIG.Coefficient_Sign Signed \
  CONFIG.Coefficient_Structure Non_Symmetric \
  CONFIG.Coefficient_Width 24 \
  CONFIG.Data_Fractional_Bits 0 \
  CONFIG.Data_Sign Signed \
  CONFIG.Data_Width 32 \
  CONFIG.Filter_Architecture Systolic_Multiply_Accumulate \
  CONFIG.Has_ARESETn true \
  CONFIG.Output_Rounding_Mode Truncate_LSBs \
  CONFIG.Output_Width 56 \
  CONFIG.Quantization Normalize_to_Centre_Coefficient \
  CONFIG.Sample_Frequency 0.048 \
] [get_bd_cells fir_compiler_7]
create_bd_cell -type ip -vlnv xilinx.com:ip:mult_gen:12.0 mult_gen_7
set_property -dict [list \
  CONFIG.Multiplier_Construction Use_Mults \
  CONFIG.PipeStages 4 \
  CONFIG.PortAWidth 16 \
  CONFIG.PortBWidth 16 \
  CONFIG.Use_Custom_Output_Width false \
] [get_bd_cells mult_gen_7]
create_bd_cell -type module -reference data_divide data_divide_2
create_bd_cell -type ip -vlnv xilinx.com:ip:dds_compiler:6.0 dds_compiler_0
set_property -dict [list \
  CONFIG.DATA_Has_TLAST Not_Required \
  CONFIG.DDS_Clock_Rate 122.88 \
  CONFIG.DSP48_Use Maximal \
  CONFIG.Frequency_Resolution 0.4 \
  CONFIG.Has_ARESETn true \
  CONFIG.Has_Phase_Out false \
  CONFIG.Latency 9 \
  CONFIG.M_DATA_Has_TUSER Not_Required \
  CONFIG.Noise_Shaping None \
  CONFIG.Optimization_Goal Speed \
  CONFIG.Output_Frequency1 0 \
  CONFIG.Output_Width 16 \
  CONFIG.PINC1 1101010101010101 \
  CONFIG.Parameter_Entry Hardware_Parameters \
  CONFIG.Phase_Increment Programmable \
  CONFIG.Phase_Width 32 \
  CONFIG.S_PHASE_Has_TUSER Not_Required \
] [get_bd_cells dds_compiler_0]
create_bd_cell -type ip -vlnv xilinx.com:ip:cic_compiler:4.0 cic_compiler_5
set_property -dict [list \
  CONFIG.Clock_Frequency 200.0 \
  CONFIG.Filter_Type Decimation \
  CONFIG.Fixed_Or_Initial_Rate 2560 \
  CONFIG.HAS_ARESETN true \
  CONFIG.Input_Data_Width 31 \
  CONFIG.Input_Sample_Frequency 0.001 \
  CONFIG.Maximum_Rate 2560 \
  CONFIG.Minimum_Rate 2560 \
  CONFIG.Number_Of_Stages 6 \
  CONFIG.Output_Data_Width 32 \
  CONFIG.Quantization Truncation \
  CONFIG.RateSpecification Sample_Period \
  CONFIG.SamplePeriod 1 \
] [get_bd_cells cic_compiler_5]
create_bd_cell -type ip -vlnv xilinx.com:ip:dds_compiler:6.0 dds_compiler_1
set_property -dict [list \
  CONFIG.DATA_Has_TLAST Not_Required \
  CONFIG.DDS_Clock_Rate 122.88 \
  CONFIG.DSP48_Use Maximal \
  CONFIG.Frequency_Resolution 0.4 \
  CONFIG.Has_ARESETn true \
  CONFIG.Has_Phase_Out false \
  CONFIG.Latency 8 \
  CONFIG.M_DATA_Has_TUSER Not_Required \
  CONFIG.Noise_Shaping None \
  CONFIG.Output_Frequency1 0 \
  CONFIG.Output_Width 16 \
  CONFIG.PINC1 0 \
  CONFIG.Parameter_Entry Hardware_Parameters \
  CONFIG.Phase_Increment Programmable \
  CONFIG.Phase_Width 32 \
  CONFIG.S_PHASE_Has_TUSER Not_Required \
] [get_bd_cells dds_compiler_1]
create_bd_cell -type ip -vlnv xilinx.com:ip:cic_compiler:4.0 cic_compiler_6
set_property -dict [list \
  CONFIG.Clock_Frequency 200.0 \
  CONFIG.Filter_Type Decimation \
  CONFIG.Fixed_Or_Initial_Rate 2560 \
  CONFIG.HAS_ARESETN true \
  CONFIG.Input_Data_Width 31 \
  CONFIG.Input_Sample_Frequency 0.001 \
  CONFIG.Maximum_Rate 2560 \
  CONFIG.Minimum_Rate 2560 \
  CONFIG.Number_Of_Channels 1 \
  CONFIG.Number_Of_Stages 6 \
  CONFIG.Output_Data_Width 32 \
  CONFIG.Quantization Truncation \
  CONFIG.RateSpecification Sample_Period \
  CONFIG.SamplePeriod 1 \
] [get_bd_cells cic_compiler_6]
create_bd_cell -type ip -vlnv xilinx.com:ip:fifo_generator:13.2 fifo_generator_0
set_property -dict [list \
  CONFIG.Enable_Safety_Circuit true \
  CONFIG.FIFO_Implementation_rach Common_Clock_Distributed_RAM \
  CONFIG.FIFO_Implementation_wach Common_Clock_Distributed_RAM \
  CONFIG.FIFO_Implementation_wrch Common_Clock_Distributed_RAM \
  CONFIG.Full_Flags_Reset_Value 1 \
  CONFIG.Full_Threshold_Assert_Value_axis 264 \
  CONFIG.INTERFACE_TYPE AXI_STREAM \
  CONFIG.Input_Depth_axis 1024 \
  CONFIG.Programmable_Full_Type_axis Single_Programmable_Full_Threshold_Constant \
  CONFIG.TDATA_NUM_BYTES 4 \
  CONFIG.TUSER_WIDTH 0 \
] [get_bd_cells fifo_generator_0]
create_bd_cell -type ip -vlnv xilinx.com:ip:fifo_generator:13.2 fifo_generator_1
set_property -dict [list \
  CONFIG.Empty_Threshold_Assert_Value_axis 66 \
  CONFIG.Enable_Safety_Circuit true \
  CONFIG.FIFO_Implementation_rach Common_Clock_Distributed_RAM \
  CONFIG.FIFO_Implementation_wach Common_Clock_Distributed_RAM \
  CONFIG.FIFO_Implementation_wrch Common_Clock_Distributed_RAM \
  CONFIG.Full_Flags_Reset_Value 1 \
  CONFIG.INTERFACE_TYPE AXI_STREAM \
  CONFIG.Input_Depth_axis 256 \
  CONFIG.Programmable_Empty_Type_axis Single_Programmable_Empty_Threshold_Constant \
  CONFIG.TDATA_NUM_BYTES 4 \
  CONFIG.TUSER_WIDTH 0 \
] [get_bd_cells fifo_generator_1]
create_bd_cell -type ip -vlnv pavel-demin:user:axi_axis_reader:1.0 FIFO_IQ_RX
create_bd_cell -type ip -vlnv pavel-demin:user:axi_axis_writer:1.0 FIFO_IQ_TX
create_bd_cell -type ip -vlnv pavel-demin:user:axi_axis_writer:1.0 FIR_RELOAD_RX

# ---- connections ----

current_bd_instance /audio
connect_bd_intf_net [get_bd_intf_pins i2s_0] [get_bd_intf_pins axi_i2s_adi_0/i2s]
connect_bd_intf_net [get_bd_intf_pins S_AXI] [get_bd_intf_pins axi_fifo_mic/S_AXI]
connect_bd_intf_net [get_bd_intf_pins S_AXI2] [get_bd_intf_pins axi_fifo_phones/S_AXI]
connect_bd_intf_net -intf_net axi_axis_writer_0_M_AXIS [get_bd_intf_pins axi_fifo_phones/M_AXIS] [get_bd_intf_pins fifo_generator_0/S_AXIS]
connect_bd_intf_net [get_bd_intf_pins axi_i2s_adi_0/m_axis] [get_bd_intf_pins fifo_generator_1/S_AXIS]
connect_bd_intf_net [get_bd_intf_pins fifo_generator_0/M_AXIS] [get_bd_intf_pins axi_i2s_adi_0/s_axis]
connect_bd_intf_net [get_bd_intf_pins fifo_generator_1/M_AXIS] [get_bd_intf_pins axi_fifo_mic/S_AXIS]
connect_bd_intf_net -intf_net smartconnect_1_M05_AXI [get_bd_intf_pins s_axi1] [get_bd_intf_pins axi_i2s_adi_0/s_axi]
connect_bd_net [get_bd_pins clk_wiz_0/clk_12m] [get_bd_pins mclk] [get_bd_pins axi_i2s_adi_0/data_clk_i]
connect_bd_net [get_bd_pins fifo_generator_0/axis_prog_empty] [get_bd_pins irq_fifo_phones]
connect_bd_net [get_bd_pins fifo_generator_1/axis_prog_full] [get_bd_pins irq_fifo_mic]
connect_bd_net -net proc_sys_reset_150M_peripheral_aresetn [get_bd_pins s_axi_aresetn] \
  [get_bd_pins axi_i2s_adi_0/s_axis_aresetn] [get_bd_pins axi_i2s_adi_0/s_axi_aresetn] \
  [get_bd_pins fifo_generator_0/s_aresetn] [get_bd_pins fifo_generator_1/s_aresetn] [get_bd_pins axi_fifo_mic/aresetn] \
  [get_bd_pins axi_fifo_phones/aresetn]
connect_bd_net -net util_ds_buf_0_BUFG_O [get_bd_pins clk_adc_i] \
  [get_bd_pins axi_i2s_adi_0/s_axis_aclk] [get_bd_pins axi_i2s_adi_0/m_axis_aclk] [get_bd_pins axi_i2s_adi_0/s_axi_aclk] \
  [get_bd_pins clk_wiz_0/clk_in1] [get_bd_pins fifo_generator_0/s_aclk] [get_bd_pins fifo_generator_1/s_aclk] \
  [get_bd_pins axi_fifo_mic/aclk] [get_bd_pins axi_fifo_phones/aclk]

current_bd_instance /video
connect_bd_intf_net [get_bd_intf_pins axi_vdma_0/M_AXIS_MM2S] [get_bd_intf_pins axis_subset_converter_0/S_AXIS]
connect_bd_intf_net [get_bd_intf_pins M_AXI_MM2S] [get_bd_intf_pins axi_vdma_0/M_AXI_MM2S]
connect_bd_intf_net [get_bd_intf_pins axis_subset_converter_0/M_AXIS] [get_bd_intf_pins v_axi4s_vid_out_0/video_in]
connect_bd_intf_net -intf_net smartconnect_1_M06_AXI [get_bd_intf_pins S_AXI_LITE] [get_bd_intf_pins axi_vdma_0/S_AXI_LITE]
connect_bd_intf_net -intf_net smartconnect_1_M08_AXI [get_bd_intf_pins ctrl] [get_bd_intf_pins v_tc_0/ctrl]
connect_bd_intf_net [get_bd_intf_pins v_tc_0/vtiming_out] [get_bd_intf_pins v_axi4s_vid_out_0/vtiming_in]
connect_bd_net [get_bd_pins lcd_remap_0/B] [get_bd_pins lcd_B]
connect_bd_net [get_bd_pins lcd_remap_0/G] [get_bd_pins lcd_G]
connect_bd_net [get_bd_pins lcd_remap_0/R] [get_bd_pins lcd_R]
connect_bd_net [get_bd_pins proc_sys_reset_0/peripheral_aresetn] [get_bd_pins v_tc_0/resetn]
connect_bd_net [get_bd_pins proc_sys_reset_0/peripheral_reset] [get_bd_pins v_axi4s_vid_out_0/vid_io_out_reset]
connect_bd_net -net proc_sys_reset_150M_peripheral_aresetn [get_bd_pins aresetn] \
  [get_bd_pins axis_subset_converter_0/aresetn] [get_bd_pins v_tc_0/s_axi_aresetn] [get_bd_pins axi_vdma_0/axi_resetn] \
  [get_bd_pins v_axi4s_vid_out_0/aresetn]
connect_bd_net -net processing_system7_0_FCLK_CLK0 [get_bd_pins lcd_clk] \
  [get_bd_pins v_tc_0/clk] [get_bd_pins proc_sys_reset_0/slowest_sync_clk] [get_bd_pins v_axi4s_vid_out_0/vid_io_out_clk]
connect_bd_net -net util_ds_buf_0_BUFG_O [get_bd_pins clk_adc_i] \
  [get_bd_pins axi_vdma_0/m_axi_mm2s_aclk] [get_bd_pins axi_vdma_0/m_axis_mm2s_aclk] \
  [get_bd_pins axis_subset_converter_0/aclk] [get_bd_pins v_tc_0/s_axi_aclk] [get_bd_pins lcd_remap_0/clk_i] \
  [get_bd_pins axi_vdma_0/s_axi_lite_aclk] [get_bd_pins v_axi4s_vid_out_0/aclk]
connect_bd_net [get_bd_pins v_axi4s_vid_out_0/vid_active_video] [get_bd_pins lcd_de]
connect_bd_net [get_bd_pins v_axi4s_vid_out_0/vid_data] [get_bd_pins lcd_remap_0/rgb_in]
connect_bd_net [get_bd_pins v_axi4s_vid_out_0/vid_hsync] [get_bd_pins lcd_hsync]
connect_bd_net [get_bd_pins v_axi4s_vid_out_0/vid_vsync] [get_bd_pins lcd_vsync]
connect_bd_net [get_bd_pins v_axi4s_vid_out_0/vtg_ce] [get_bd_pins v_tc_0/gen_clken]
connect_bd_net [get_bd_pins v_tc_0/irq] [get_bd_pins irq]
connect_bd_net -net zynq_ultra_ps_e_0_pl_resetn0 [get_bd_pins ext_reset_in] [get_bd_pins proc_sys_reset_0/ext_reset_in]

current_bd_instance /iq_modem
connect_bd_intf_net [get_bd_intf_pins S_AXI_FIFO_IQ_TX] [get_bd_intf_pins FIFO_IQ_TX/S_AXI]
connect_bd_intf_net [get_bd_intf_pins S_AXI_FIR_RELOAD_RX] [get_bd_intf_pins FIR_RELOAD_RX/S_AXI]
connect_bd_intf_net [get_bd_intf_pins S_AXI_FIFO_IQ_RX] [get_bd_intf_pins FIFO_IQ_RX/S_AXI]
connect_bd_intf_net -intf_net axi_axis_writer_0_M_AXIS [get_bd_intf_pins FIFO_IQ_TX/M_AXIS] [get_bd_intf_pins fifo_generator_1/S_AXIS]
connect_bd_intf_net -intf_net axi_axis_writer_0_M_AXIS1 [get_bd_intf_pins FIR_RELOAD_RX/M_AXIS] [get_bd_intf_pins axis_broadcaster_0/S_AXIS]
connect_bd_intf_net [get_bd_intf_pins axis_broadcaster_0/M00_AXIS] [get_bd_intf_pins fir_compiler_4/S_AXIS_RELOAD]
connect_bd_intf_net [get_bd_intf_pins axis_broadcaster_0/M01_AXIS] [get_bd_intf_pins fir_compiler_5/S_AXIS_RELOAD]
connect_bd_intf_net [get_bd_intf_pins axis_broadcaster_0/M02_AXIS] [get_bd_intf_pins fir_compiler_6/S_AXIS_RELOAD]
connect_bd_intf_net [get_bd_intf_pins axis_broadcaster_0/M03_AXIS] [get_bd_intf_pins fir_compiler_7/S_AXIS_RELOAD]
connect_bd_intf_net [get_bd_intf_pins axis_broadcaster_1/M00_AXIS] [get_bd_intf_pins cic_compiler_0/S_AXIS_DATA]
connect_bd_intf_net [get_bd_intf_pins axis_broadcaster_1/M01_AXIS] [get_bd_intf_pins cic_compiler_1/S_AXIS_DATA]
connect_bd_intf_net [get_bd_intf_pins cic_compiler_2/M_AXIS_DATA] [get_bd_intf_pins fir_compiler_0/S_AXIS_DATA]
connect_bd_intf_net [get_bd_intf_pins cic_compiler_3/M_AXIS_DATA] [get_bd_intf_pins fir_compiler_1/S_AXIS_DATA]
connect_bd_intf_net [get_bd_intf_pins cic_compiler_4/M_AXIS_DATA] [get_bd_intf_pins fir_compiler_4/S_AXIS_DATA]
connect_bd_intf_net [get_bd_intf_pins cic_compiler_5/M_AXIS_DATA] [get_bd_intf_pins fir_compiler_5/S_AXIS_DATA]
connect_bd_intf_net [get_bd_intf_pins cic_compiler_6/M_AXIS_DATA] [get_bd_intf_pins fir_compiler_6/S_AXIS_DATA]
connect_bd_intf_net [get_bd_intf_pins cic_compiler_7/M_AXIS_DATA] [get_bd_intf_pins fir_compiler_7/S_AXIS_DATA]
connect_bd_intf_net [get_bd_intf_pins fifo_generator_0/M_AXIS] [get_bd_intf_pins FIFO_IQ_RX/S_AXIS]
connect_bd_intf_net [get_bd_intf_pins fifo_generator_1/M_AXIS] [get_bd_intf_pins fir_compiler_2/S_AXIS_DATA]
connect_bd_intf_net [get_bd_intf_pins fir_compiler_0/M_AXIS_DATA] [get_bd_intf_pins iq_to_fifo_shifted_0/s04_axis_i96]
connect_bd_intf_net [get_bd_intf_pins fir_compiler_1/M_AXIS_DATA] [get_bd_intf_pins iq_to_fifo_shifted_0/s05_axis_q96]
connect_bd_intf_net [get_bd_intf_pins fir_compiler_2/M_AXIS_DATA] [get_bd_intf_pins axis_broadcaster_1/S_AXIS]
connect_bd_intf_net [get_bd_intf_pins fir_compiler_4/M_AXIS_DATA] [get_bd_intf_pins iq_to_fifo_shifted_0/s00_axis_i48]
connect_bd_intf_net [get_bd_intf_pins fir_compiler_5/M_AXIS_DATA] [get_bd_intf_pins iq_to_fifo_shifted_0/s01_axis_q48]
connect_bd_intf_net [get_bd_intf_pins fir_compiler_6/M_AXIS_DATA] [get_bd_intf_pins iq_to_fifo_shifted_0/s02_axis_i48_sub]
connect_bd_intf_net [get_bd_intf_pins fir_compiler_7/M_AXIS_DATA] [get_bd_intf_pins iq_to_fifo_shifted_0/s03_axis_q48_sub]
connect_bd_intf_net [get_bd_intf_pins iq_to_fifo_shifted_0/m00_axis] [get_bd_intf_pins fifo_generator_0/S_AXIS]
connect_bd_intf_net -intf_net smartconnect_1_M07_AXI [get_bd_intf_pins S_AXI_TRX_CONTROL] [get_bd_intf_pins trx_control2_0/S00_AXI]
connect_bd_net [get_bd_pins DAC_OUT_0/DATA_OUT] [get_bd_pins dac_out]
connect_bd_net [get_bd_pins data_latch_0/data_out] \
  [get_bd_pins mult_gen_0/A] [get_bd_pins mult_gen_1/A] [get_bd_pins mult_gen_2/A] [get_bd_pins mult_gen_3/A] \
  [get_bd_pins mult_gen_6/A] [get_bd_pins mult_gen_7/A]
connect_bd_net [get_bd_pins trx_control2_0/dds_valid] \
  [get_bd_pins dds_compiler_0/s_axis_config_tvalid] [get_bd_pins dds_compiler_1/s_axis_config_tvalid] \
  [get_bd_pins dds_compiler_2/s_axis_config_tvalid]
connect_bd_net [get_bd_pins dds_compiler_2/m_axis_data_tvalid] \
  [get_bd_pins cic_compiler_6/s_axis_data_tvalid] [get_bd_pins cic_compiler_7/s_axis_data_tvalid]
connect_bd_net [get_bd_pins dds_compiler_0/m_axis_data_tvalid] \
  [get_bd_pins cic_compiler_4/s_axis_data_tvalid] [get_bd_pins cic_compiler_5/s_axis_data_tvalid]
connect_bd_net [get_bd_pins dds_compiler_1/m_axis_data_tvalid] \
  [get_bd_pins cic_compiler_2/s_axis_data_tvalid] [get_bd_pins cic_compiler_3/s_axis_data_tvalid]
connect_bd_net [get_bd_pins xlconstant_2/dout] \
  [get_bd_pins fir_compiler_4/s_axis_config_tdata] [get_bd_pins fir_compiler_5/s_axis_config_tdata] \
  [get_bd_pins fir_compiler_6/s_axis_config_tdata] [get_bd_pins fir_compiler_7/s_axis_config_tdata]
connect_bd_net [get_bd_pins xlconstant_4/dout] \
  [get_bd_pins fir_compiler_4/s_axis_config_tvalid] [get_bd_pins fir_compiler_5/s_axis_config_tvalid] \
  [get_bd_pins fir_compiler_6/s_axis_config_tvalid] [get_bd_pins fir_compiler_7/s_axis_config_tvalid]
connect_bd_net [get_bd_pins adc_in] [get_bd_pins data_latch_0/data_in_adc]
connect_bd_net [get_bd_pins c_addsub_0/S] [get_bd_pins DAC_OUT_0/DATA_IN] [get_bd_pins data_latch_0/data_in_tx_loopback]
connect_bd_net [get_bd_pins cic_compiler_0/m_axis_data_tdata] [get_bd_pins mult_gen_4/B]
connect_bd_net [get_bd_pins cic_compiler_1/m_axis_data_tdata] [get_bd_pins mult_gen_5/B]
connect_bd_net [get_bd_pins data_divide_0/data_1] [get_bd_pins mult_gen_0/B] [get_bd_pins mult_gen_4/A]
connect_bd_net [get_bd_pins data_divide_0/data_2] [get_bd_pins mult_gen_1/B] [get_bd_pins mult_gen_5/A]
connect_bd_net [get_bd_pins data_divide_1/data_1] [get_bd_pins mult_gen_2/B]
connect_bd_net [get_bd_pins data_divide_1/data_2] [get_bd_pins mult_gen_3/B]
connect_bd_net [get_bd_pins data_divide_2/data_1] [get_bd_pins mult_gen_6/B]
connect_bd_net [get_bd_pins data_divide_2/data_2] [get_bd_pins mult_gen_7/B]
connect_bd_net [get_bd_pins dds_compiler_0/m_axis_data_tdata] [get_bd_pins data_divide_0/data_in]
connect_bd_net [get_bd_pins dds_compiler_1/m_axis_data_tdata] [get_bd_pins data_divide_1/data_in]
connect_bd_net [get_bd_pins dds_compiler_2/m_axis_data_tdata] [get_bd_pins data_divide_2/data_in]
connect_bd_net [get_bd_pins fifo_generator_0/axis_prog_full] [get_bd_pins irq_fifo_iq_receive]
connect_bd_net [get_bd_pins fifo_generator_1/axis_prog_empty] [get_bd_pins irq_fifo_iq_transmit]
connect_bd_net [get_bd_pins mult_gen_0/P] [get_bd_pins cic_compiler_4/s_axis_data_tdata]
connect_bd_net [get_bd_pins mult_gen_1/P] [get_bd_pins cic_compiler_5/s_axis_data_tdata]
connect_bd_net [get_bd_pins mult_gen_2/P] [get_bd_pins cic_compiler_2/s_axis_data_tdata]
connect_bd_net [get_bd_pins mult_gen_3/P] [get_bd_pins cic_compiler_3/s_axis_data_tdata]
connect_bd_net [get_bd_pins mult_gen_4/P] [get_bd_pins c_addsub_0/A]
connect_bd_net [get_bd_pins mult_gen_5/P] [get_bd_pins c_addsub_0/B]
connect_bd_net [get_bd_pins mult_gen_6/P] [get_bd_pins cic_compiler_6/s_axis_data_tdata]
connect_bd_net [get_bd_pins mult_gen_7/P] [get_bd_pins cic_compiler_7/s_axis_data_tdata]
connect_bd_net -net proc_sys_reset_150M_peripheral_aresetn [get_bd_pins axi_resetn] \
  [get_bd_pins axis_broadcaster_0/aresetn] [get_bd_pins cic_compiler_0/aresetn] [get_bd_pins cic_compiler_1/aresetn] \
  [get_bd_pins cic_compiler_2/aresetn] [get_bd_pins cic_compiler_3/aresetn] [get_bd_pins cic_compiler_4/aresetn] \
  [get_bd_pins cic_compiler_5/aresetn] [get_bd_pins cic_compiler_6/aresetn] [get_bd_pins cic_compiler_7/aresetn] \
  [get_bd_pins dds_compiler_0/aresetn] [get_bd_pins dds_compiler_1/aresetn] [get_bd_pins dds_compiler_2/aresetn] \
  [get_bd_pins fir_compiler_0/aresetn] [get_bd_pins fir_compiler_1/aresetn] [get_bd_pins fir_compiler_2/aresetn] \
  [get_bd_pins fir_compiler_4/aresetn] [get_bd_pins fir_compiler_5/aresetn] [get_bd_pins fir_compiler_6/aresetn] \
  [get_bd_pins fir_compiler_7/aresetn] [get_bd_pins axis_broadcaster_1/aresetn] [get_bd_pins trx_control2_0/s00_axi_aresetn] \
  [get_bd_pins fifo_generator_0/s_aresetn] [get_bd_pins fifo_generator_1/s_aresetn] [get_bd_pins FIFO_IQ_RX/aresetn] \
  [get_bd_pins FIFO_IQ_TX/aresetn] [get_bd_pins FIR_RELOAD_RX/aresetn]
connect_bd_net [get_bd_pins trx_control2_0/dds_ftw] [get_bd_pins dds_compiler_0/s_axis_config_tdata]
connect_bd_net [get_bd_pins trx_control2_0/dds_ftw_sub] [get_bd_pins dds_compiler_2/s_axis_config_tdata]
connect_bd_net [get_bd_pins trx_control2_0/dds_rts] [get_bd_pins dds_compiler_1/s_axis_config_tdata]
connect_bd_net [get_bd_pins trx_control2_0/rx_iq_shift] [get_bd_pins iq_to_fifo_shifted_0/distance]
connect_bd_net [get_bd_pins trx_control2_0/tx_shift] [get_bd_pins DAC_OUT_0/shift]
connect_bd_net -net trx_control_0_tx [get_bd_pins trx_control2_0/tx] [get_bd_pins DAC_OUT_0/tx] [get_bd_pins data_latch_0/source]
connect_bd_net -net util_ds_buf_0_BUFG_O [get_bd_pins clk_adc_i] \
  [get_bd_pins DAC_OUT_0/clk_in] [get_bd_pins axis_broadcaster_0/aclk] [get_bd_pins c_addsub_0/CLK] \
  [get_bd_pins cic_compiler_0/aclk] [get_bd_pins cic_compiler_1/aclk] [get_bd_pins cic_compiler_2/aclk] \
  [get_bd_pins cic_compiler_3/aclk] [get_bd_pins cic_compiler_4/aclk] [get_bd_pins cic_compiler_5/aclk] \
  [get_bd_pins cic_compiler_6/aclk] [get_bd_pins cic_compiler_7/aclk] [get_bd_pins data_divide_0/clk_i] \
  [get_bd_pins data_divide_2/clk_i] [get_bd_pins data_divide_1/clk_i] [get_bd_pins dds_compiler_0/aclk] \
  [get_bd_pins dds_compiler_1/aclk] [get_bd_pins dds_compiler_2/aclk] [get_bd_pins fir_compiler_0/aclk] \
  [get_bd_pins fir_compiler_1/aclk] [get_bd_pins fir_compiler_2/aclk] [get_bd_pins fir_compiler_4/aclk] \
  [get_bd_pins fir_compiler_5/aclk] [get_bd_pins fir_compiler_6/aclk] [get_bd_pins fir_compiler_7/aclk] \
  [get_bd_pins mult_gen_0/CLK] [get_bd_pins mult_gen_1/CLK] [get_bd_pins mult_gen_2/CLK] [get_bd_pins mult_gen_3/CLK] \
  [get_bd_pins mult_gen_6/CLK] [get_bd_pins mult_gen_7/CLK] [get_bd_pins mult_gen_4/CLK] [get_bd_pins mult_gen_5/CLK] \
  [get_bd_pins iq_to_fifo_shifted_0/axis_aclk] [get_bd_pins data_latch_0/clk_i] [get_bd_pins axis_broadcaster_1/aclk] \
  [get_bd_pins trx_control2_0/s00_axi_aclk] [get_bd_pins fifo_generator_0/s_aclk] [get_bd_pins fifo_generator_1/s_aclk] \
  [get_bd_pins FIFO_IQ_RX/aclk] [get_bd_pins FIFO_IQ_TX/aclk] [get_bd_pins FIR_RELOAD_RX/aclk]

current_bd_instance /
connect_bd_intf_net -intf_net S00_AXI_1 [get_bd_intf_pins iq_modem/S_AXI_TRX_CONTROL] [get_bd_intf_pins smartconnect_1/M05_AXI]
connect_bd_intf_net -intf_net S_AXI2_1 [get_bd_intf_pins audio/S_AXI2] [get_bd_intf_pins smartconnect_1/M04_AXI]
connect_bd_intf_net [get_bd_intf_pins audio/S_AXI] [get_bd_intf_pins smartconnect_1/M03_AXI]
connect_bd_intf_net [get_bd_intf_pins video/S_AXI_LITE] [get_bd_intf_pins smartconnect_1/M00_AXI]
connect_bd_intf_net [get_bd_intf_ports i2s_0] [get_bd_intf_pins audio/i2s_0]
connect_bd_intf_net [get_bd_intf_pins video/ctrl] [get_bd_intf_pins smartconnect_1/M01_AXI]
connect_bd_intf_net [get_bd_intf_ports DDR] [get_bd_intf_pins processing_system7_0/DDR]
connect_bd_intf_net [get_bd_intf_ports FIXED_IO] [get_bd_intf_pins processing_system7_0/FIXED_IO]
connect_bd_intf_net [get_bd_intf_ports GPIO_0] [get_bd_intf_pins processing_system7_0/GPIO_0]
connect_bd_intf_net [get_bd_intf_pins smartconnect_1/S00_AXI] [get_bd_intf_pins processing_system7_0/M_AXI_GP0]
connect_bd_intf_net -intf_net s_axi1_1 [get_bd_intf_pins audio/s_axi1] [get_bd_intf_pins smartconnect_1/M02_AXI]
connect_bd_intf_net [get_bd_intf_pins smartconnect_0/M00_AXI] [get_bd_intf_pins processing_system7_0/S_AXI_HP0]
connect_bd_intf_net [get_bd_intf_pins smartconnect_1/M06_AXI] [get_bd_intf_pins iq_modem/S_AXI_FIFO_IQ_RX]
connect_bd_intf_net [get_bd_intf_pins smartconnect_1/M07_AXI] [get_bd_intf_pins iq_modem/S_AXI_FIFO_IQ_TX]
connect_bd_intf_net [get_bd_intf_pins smartconnect_1/M08_AXI] [get_bd_intf_pins iq_modem/S_AXI_FIR_RELOAD_RX]
connect_bd_intf_net [get_bd_intf_pins smartconnect_1/M09_AXI] [get_bd_intf_pins cpu_fan_pwm_0/S00_AXI]
connect_bd_intf_net [get_bd_intf_pins smartconnect_1/M10_AXI] [get_bd_intf_pins dcdc_pwm_1/S00_AXI]
connect_bd_intf_net [get_bd_intf_pins smartconnect_0/S00_AXI] [get_bd_intf_pins video/M_AXI_MM2S]
connect_bd_net -net DAC_OUT_0_DATA_OUT [get_bd_pins iq_modem/dac_out] [get_bd_ports dac_out]
connect_bd_net [get_bd_ports adc_in] [get_bd_pins iq_modem/adc_in]
connect_bd_net -net ax_pwm_0_pwm [get_bd_pins cpu_fan_pwm_0/pwm] [get_bd_ports cpu_fan_pwm]
connect_bd_net -net ax_pwm_1_pwm [get_bd_pins dcdc_pwm_1/pwm] [get_bd_ports dcdc_pwm]
connect_bd_net -net axi_dma_if_tx_mm2s_introut [get_bd_pins iq_modem/irq_fifo_iq_transmit] [get_bd_pins xlconcat_0/In1]
connect_bd_net -net axi_fifo_mm_s_0_interrupt [get_bd_pins iq_modem/irq_fifo_iq_receive] [get_bd_pins xlconcat_0/In2]
connect_bd_net -net axi_fifo_mm_s_1_interrupt [get_bd_pins audio/irq_fifo_phones] [get_bd_pins xlconcat_0/In4]
connect_bd_net -net axi_fifo_phones_interrupt [get_bd_pins audio/irq_fifo_mic] [get_bd_pins xlconcat_0/In3]
connect_bd_net -net clk_wiz_0_clk_12m [get_bd_pins audio/mclk] [get_bd_ports mclk]
connect_bd_net -net lcd_remap_0_B [get_bd_pins video/lcd_B] [get_bd_ports lcd_B]
connect_bd_net -net lcd_remap_0_G [get_bd_pins video/lcd_G] [get_bd_ports lcd_G]
connect_bd_net -net lcd_remap_0_R [get_bd_pins video/lcd_R] [get_bd_ports lcd_R]
connect_bd_net [get_bd_pins proc_sys_reset_150M/peripheral_aresetn] \
  [get_bd_pins smartconnect_0/aresetn] [get_bd_pins smartconnect_1/aresetn] [get_bd_pins cpu_fan_pwm_0/s00_axi_aresetn] \
  [get_bd_pins dcdc_pwm_1/s00_axi_aresetn] [get_bd_pins audio/s_axi_aresetn] [get_bd_pins video/aresetn] \
  [get_bd_pins iq_modem/axi_resetn]
connect_bd_net [get_bd_pins processing_system7_0/FCLK_CLK0] [get_bd_ports lcd_clk] [get_bd_pins video/lcd_clk]
connect_bd_net -net util_ds_buf_0_BUFG_O [get_bd_ports clk_adc_i] \
  [get_bd_pins proc_sys_reset_150M/slowest_sync_clk] [get_bd_pins smartconnect_0/aclk] [get_bd_pins smartconnect_1/aclk] \
  [get_bd_pins processing_system7_0/S_AXI_HP0_ACLK] [get_bd_pins processing_system7_0/M_AXI_GP0_ACLK] \
  [get_bd_pins cpu_fan_pwm_0/s00_axi_aclk] [get_bd_pins dcdc_pwm_1/s00_axi_aclk] [get_bd_pins audio/clk_adc_i] \
  [get_bd_pins video/clk_adc_i] [get_bd_pins iq_modem/clk_adc_i]
connect_bd_net -net v_tc_0_irq [get_bd_pins video/irq] [get_bd_pins xlconcat_0/In0]
connect_bd_net [get_bd_pins video/lcd_de] [get_bd_ports lcd_de]
connect_bd_net [get_bd_pins video/lcd_hsync] [get_bd_ports lcd_hsync]
connect_bd_net [get_bd_pins video/lcd_vsync] [get_bd_ports lcd_vsync]
connect_bd_net [get_bd_pins xlconcat_0/dout] [get_bd_pins processing_system7_0/IRQ_F2P]
connect_bd_net -net zynq_ultra_ps_e_0_pl_resetn0 [get_bd_pins processing_system7_0/FCLK_RESET0_N] \
  [get_bd_pins proc_sys_reset_150M/ext_reset_in] [get_bd_pins video/ext_reset_in]

# ---- address map ----
assign_bd_address -offset 0x43000000 -range 64K -target_address_space [get_bd_addr_spaces processing_system7_0/Data] [get_bd_addr_segs video/axi_vdma_0/S_AXI_LITE/Reg]
assign_bd_address -offset 0x43C00000 -range 64K -target_address_space [get_bd_addr_spaces processing_system7_0/Data] [get_bd_addr_segs iq_modem/FIFO_IQ_RX/s_axi/reg0]
assign_bd_address -offset 0x43C10000 -range 64K -target_address_space [get_bd_addr_spaces processing_system7_0/Data] [get_bd_addr_segs audio/axi_fifo_mic/s_axi/reg0]
assign_bd_address -offset 0x43C20000 -range 64K -target_address_space [get_bd_addr_spaces processing_system7_0/Data] [get_bd_addr_segs cpu_fan_pwm_0/S00_AXI/S00_AXI_reg]
assign_bd_address -offset 0x43C30000 -range 64K -target_address_space [get_bd_addr_spaces processing_system7_0/Data] [get_bd_addr_segs audio/axi_i2s_adi_0/s_axi/axi_lite]
assign_bd_address -offset 0x43C40000 -range 64K -target_address_space [get_bd_addr_spaces processing_system7_0/Data] [get_bd_addr_segs iq_modem/trx_control2_0/S00_AXI/S00_AXI_reg]
assign_bd_address -offset 0x43C50000 -range 64K -target_address_space [get_bd_addr_spaces processing_system7_0/Data] [get_bd_addr_segs video/v_tc_0/ctrl/Reg]
assign_bd_address -offset 0x43C60000 -range 64K -target_address_space [get_bd_addr_spaces processing_system7_0/Data] [get_bd_addr_segs audio/axi_fifo_phones/s_axi/reg0]
assign_bd_address -offset 0x43C70000 -range 64K -target_address_space [get_bd_addr_spaces processing_system7_0/Data] [get_bd_addr_segs dcdc_pwm_1/S00_AXI/S00_AXI_reg]
assign_bd_address -offset 0x43C80000 -range 64K -target_address_space [get_bd_addr_spaces processing_system7_0/Data] [get_bd_addr_segs iq_modem/FIFO_IQ_TX/s_axi/reg0]
assign_bd_address -offset 0x43C90000 -range 64K -target_address_space [get_bd_addr_spaces processing_system7_0/Data] [get_bd_addr_segs iq_modem/FIR_RELOAD_RX/s_axi/reg0]
assign_bd_address -offset 0x00000000 -range 512M -target_address_space [get_bd_addr_spaces video/axi_vdma_0/Data_MM2S] [get_bd_addr_segs processing_system7_0/S_AXI_HP0/HP0_DDR_LOWOCM]

validate_bd_design
save_bd_design
